# Altium schematic sheet Signals.SchDoc
size A2
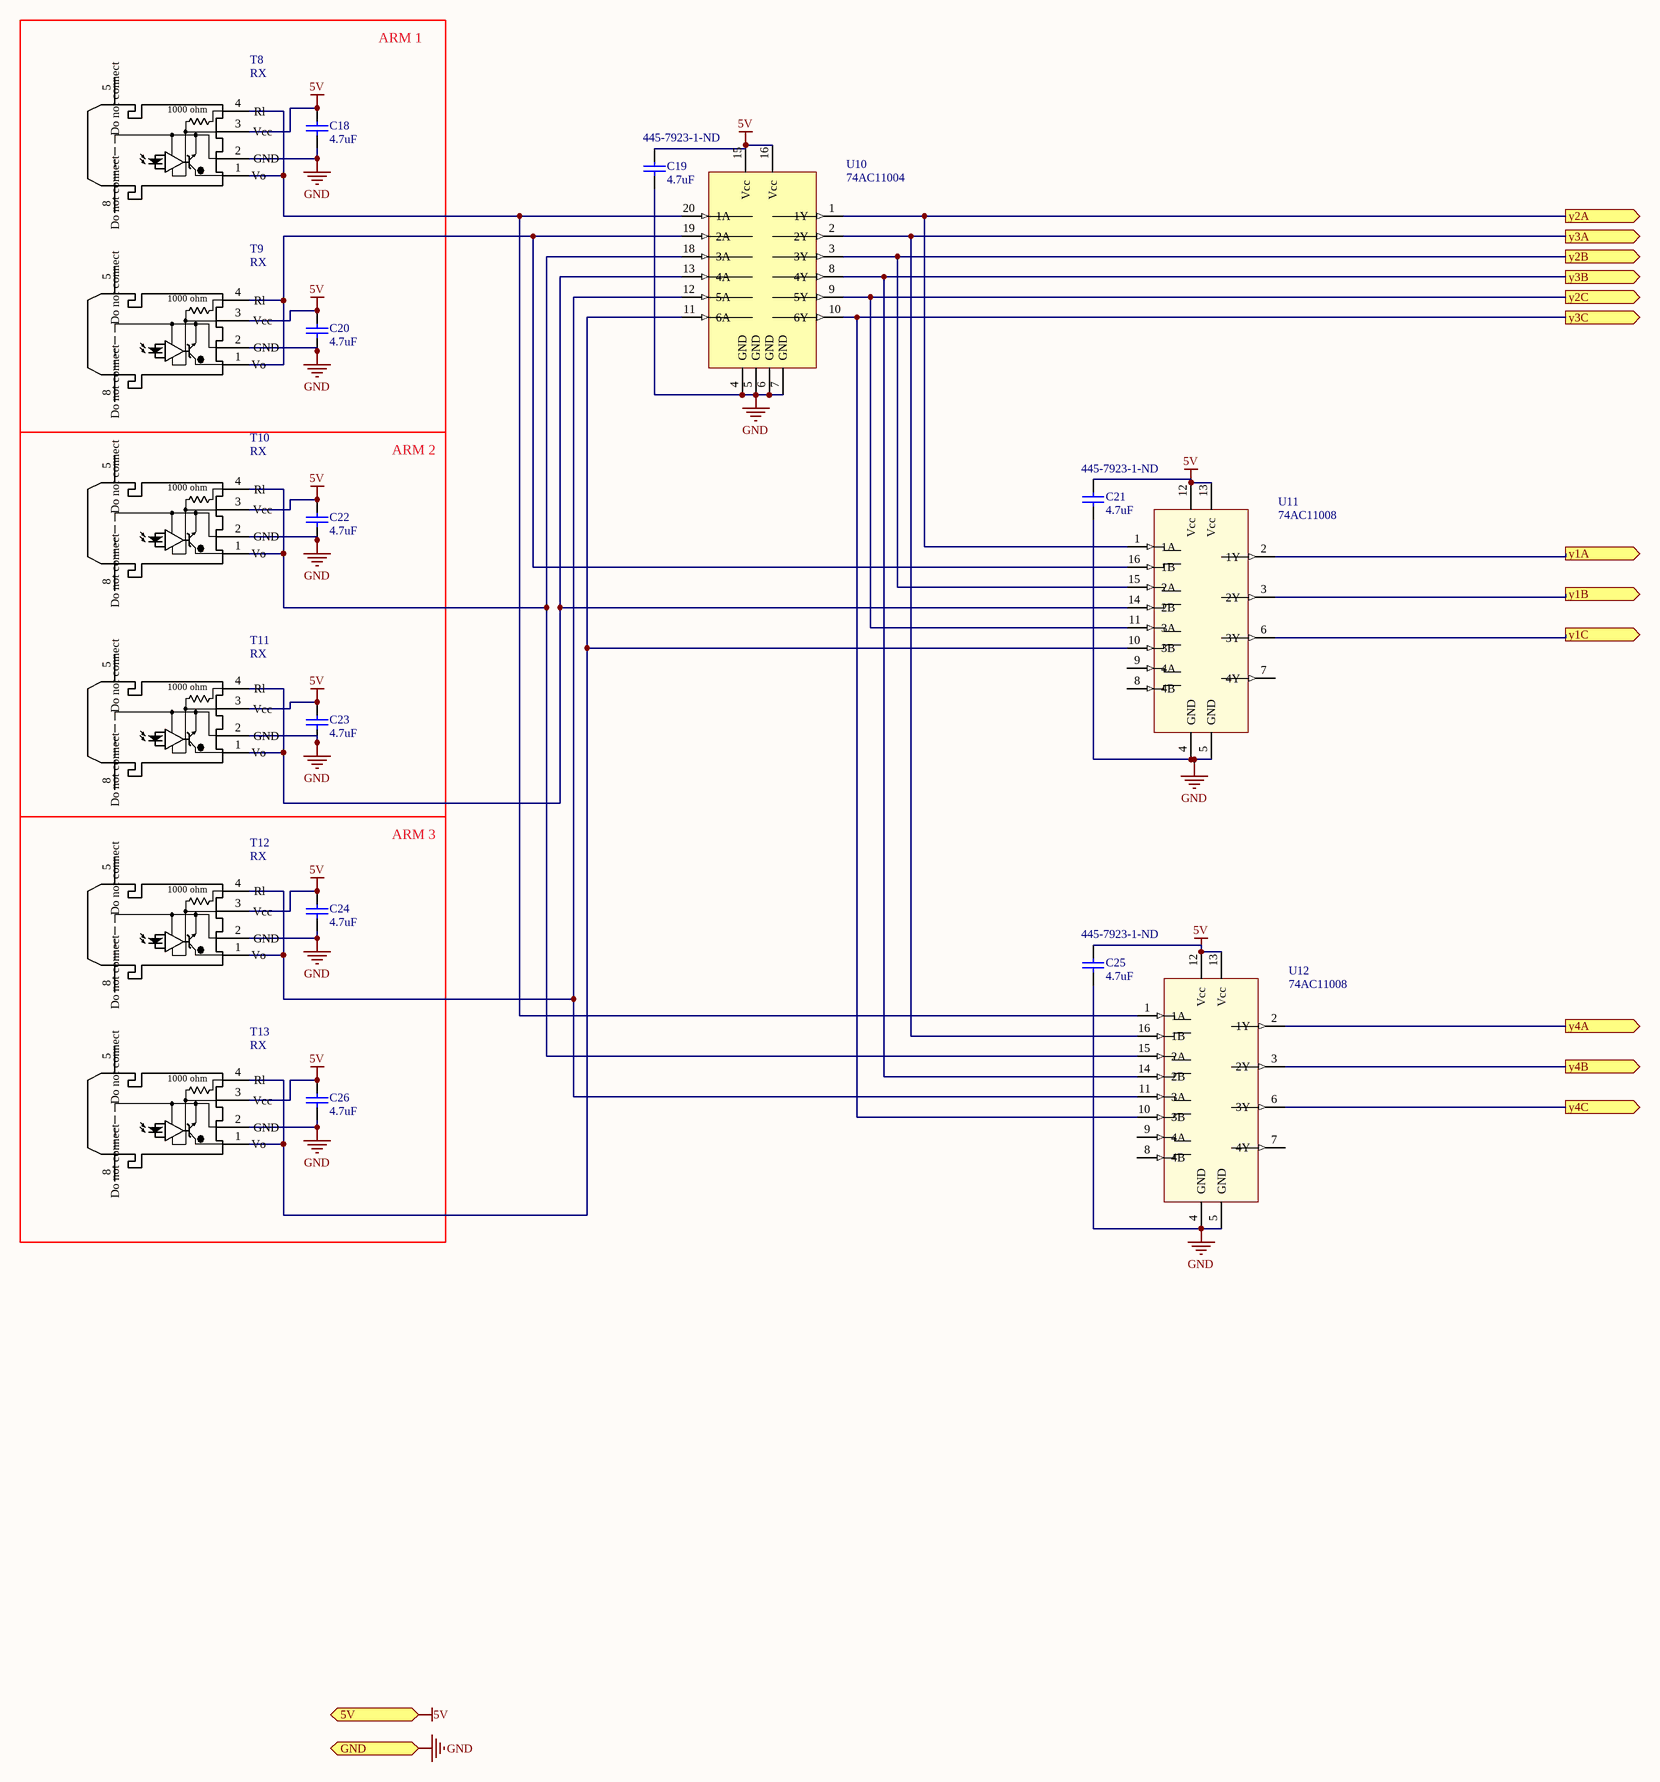
[diagram p0: Signals.SchDoc]

## Parts
C18  value 4.7uF  [C4532]  (hidden comment: Cap)
C19  value 4.7uF  Supplier Part Number 1: 445-7923-1-ND  [C4532]  (hidden comment: Cap)
C20  value 4.7uF  [C4532]  (hidden comment: Cap)
C21  value 4.7uF  Supplier Part Number 1: 445-7923-1-ND  [C4532]  (hidden comment: Cap)
C22  value 4.7uF  [C4532]  (hidden comment: Cap)
C23  value 4.7uF  [C4532]  (hidden comment: Cap)
C24  value 4.7uF  [C4532]  (hidden comment: Cap)
C25  value 4.7uF  Supplier Part Number 1: 445-7923-1-ND  [C4532]  (hidden comment: Cap)
C26  value 4.7uF  [C4532]  (hidden comment: Cap)
T8  RX  [Optics]
T9  RX  [Optics]
T10  RX  [Optics]
T11  RX  [Optics]
T12  RX  [Optics]
T13  RX  [Optics]
U10  74AC11004  [R-PDIP-T20]
U11  74AC11008  [R-PDIP-T16]
U12  74AC11008  [R-PDIP-T16]

## Blocks framed on the sheet
ARM 1: C18 C20 T8 T9
ARM 2: C22 C23 T10 T11
ARM 3: C24 C26 T12 T13

## Ports
5V, GND, y1A (out), y1B (out), y1C (out), y2A (out), y2B (out), y2C (out), y3A (out), y3B (out), y3C (out), y4A (out), y4B (out), y4C (out)

## Nets
5V: C18.2 C19.2 C20.2 C21.2 C22.2 C23.2 C24.2 C25.2 C26.2 T8.3(Vcc) T9.3(Vcc) T10.3(Vcc) T11.3(Vcc) T12.3(Vcc) T13.3(Vcc) U10.15(Vcc) U10.16(Vcc) U11.12(Vcc) U11.13(Vcc) U12.12(Vcc) U12.13(Vcc) ; port 5V
GND: C18.1 C19.1 C20.1 C21.1 C22.1 C23.1 C24.1 C25.1 C26.1 T8.2(GND) T9.2(GND) T10.2(GND) T11.2(GND) T12.2(GND) T13.2(GND) U10.4(GND) U10.5(GND) U10.6(GND) U10.7(GND) U11.4(GND) U11.5(GND) U12.4(GND) U12.5(GND) ; port GND
y1A: U11.2(1Y) ; port y1A
y1B: U11.3(2Y) ; port y1B
y1C: U11.6(3Y) ; port y1C
y2A: U10.1(1Y) U11.1(1A) ; port y2A
y2B: U10.3(3Y) U11.15(2A) ; port y2B
y2C: U10.9(5Y) U11.11(3A) ; port y2C
y3A: U10.2(2Y) U12.16(1B) ; port y3A
y3B: U10.8(4Y) U12.14(2B) ; port y3B
y3C: U10.10(6Y) U12.10(3B) ; port y3C
y4A: U12.2(1Y) ; port y4A
y4B: U12.3(2Y) ; port y4B
y4C: U12.6(3Y) ; port y4C
NetT8_1: T8.1(Vo) T8.4(Rl) U10.20(1A) U12.1(1A)
NetT9_1: T9.1(Vo) T9.4(Rl) U10.19(2A) U11.16(1B)
NetT10_1: T10.1(Vo) T10.4(Rl) U10.18(3A) U12.15(2A)
NetT11_1: T11.1(Vo) T11.4(Rl) U10.13(4A) U11.14(2B)
NetT12_1: T12.1(Vo) T12.4(Rl) U10.12(5A) U12.11(3A)
NetT13_1: T13.1(Vo) T13.4(Rl) U10.11(6A) U11.10(3B)

Not connected (* = marked no-connect by the designer): T8 5(Do_not_connect) 8(Do_not_connect); T9 5(Do_not_connect) 8(Do_not_connect); T10 5(Do_not_connect) 8(Do_not_connect); T11 5(Do_not_connect) 8(Do_not_connect); T12 5(Do_not_connect) 8(Do_not_connect); T13 5(Do_not_connect) 8(Do_not_connect); U11 7(4Y) 8(4B) 9(4A); U12 7(4Y) 8(4B) 9(4A)

## Notes on the sheet
- (in symbol HFBR-2524Z) 1000 ohm

## Library data of the parts
C18 C20 C22-C24 C26 = Cap: Capacitor; Published: 8-Jun-2000; LatestRevisionDate: 17-Jul-2002; LatestRevisionNote: Re-released for DXP Platform.; PackageReference: RAD-0.3; Publisher: Altium Limited; PackageDescription: Radial Cap, Thru-Hole; 2 Leads; 0.3 in Pin Spacing
C19 C21 C25 = Cap: Capacitor; Manufacturer: TDK; Manufacturer Part Number: CGA8N3X7S2A475K230KB; Tolerance: 10%; Voltage Rating: 100V; Dielectric: X7S; Published: 8-Jun-2000; LatestRevisionDate: 17-Jul-2002; LatestRevisionNote: Re-released for DXP Platform.; PackageReference: RAD-0.3; Publisher: Altium Limited; PackageDescription: Radial Cap, Thru-Hole; 2 Leads; 0.3 in Pin Spacing; Supplier 1: Digi-Key; Stock 1: 0; Pricing 1: 1=1.92, 10=1.518, 100=1.1385 (USD); Case/Package: 1812; Weight: 0.000952oz; Case Code (Metric): 4532; Case Code (Imperial): 1812; Min Operating Temperature: -55°C; Max Operating Temperature: 125°C; Packaging: Tape and Reel; Package Quantity: 1; Capacitance: 4.7uF; Voltage Rating (DC): 100V; Termination: SMD/SMT; Composition: Ceramic; Length: 4.5mm; Height: 1.6mm; Width: 0.126inch; Thickness: 0.091inch; Depth: 3.2mm; REACH SVHC: No SVHC; ComponentLink1URL: https://datasheet.ciiva.com/24217/cga8n3x7s2a475k230kb-266118-24217101.pdf; ComponentLink1Description: https://datasheet.ciiva.com/24217/cga8n3x7s2a475k230kb-266118-24217101.pdf
T8-T13 = HFBR-2524Z: Optical Reciever
U10 = 74AC11004: Hex Inverter; Manufacturer: Texas Instruments; Manufacturer Part Number: 74AC11004N; Logic Function: Buffer,Inverter; Number of Elements: 6; Supply Voltage: 5V; Propagation Delay: 10ns; Max Supply Voltage: 5.5V; Min Supply Voltage: 3V; Number of Inputs: 1; Output Current: 24mA; Quiescent Current: 4uA; High Level Output Current: -24mA; Schmitt Trigger Input: No; Supplier 1: Digikey; Stock 1: 747; Pricing 1: 1=2.36, 10=2.12, 100=1.704, 500=1.4, 1000=1.16 (USD); Mount: Through Hole; Case/Package: PDIP; Number of Pins: 20; Weight: 0.042297oz; Contact Plating: Gold; Min Operating Temperature: -40°C; Max Operating Temperature: 85°C; Packaging: Rail/Tube; Package Quantity: 20; Number of Circuits: 6; Low Level Output Current: 24mA; Turn-On Delay Time: 10ns; Number of Gates: 6; Number of Bits: 6; Length: 26.92mm; Height: 4.57mm; Width: 6.6mm; Radiation Hardening: No; Lead Free: Lead Free; REACH SVHC: No SVHC; ComponentLink1URL: https://datasheet.ciiva.com/14289/74ac11004-14289990.pdf; ComponentLink1Description: https://datasheet.ciiva.com/14289/74ac11004-14289990.pdf; ComponentLink2URL: https://datasheet.ciiva.com/1869/74ac11004-1869911.pdf; ComponentLink2Description: https://datasheet.ciiva.com/1869/74ac11004-1869911.pdf; ComponentLink3URL: https://datasheet.ciiva.com/1157/1763878-1157128.pdf; ComponentLink3Description: https://datasheet.ciiva.com/1157/1763878-1157128.pdf; ComponentLink4URL: https://datasheet.ciiva.com/15089/getdatasheetpartid-371764-15089641.pdf; ComponentLink4Description: https://datasheet.ciiva.com/15089/getdatasheetpartid-371764-15089641.pdf; ComponentLink5URL: https://datasheet.ciiva.com/1153/1817335-1153741.pdf; ComponentLink5Description: https://datasheet.ciiva.com/1153/1817335-1153741.pdf; ComponentLink6URL: https://datasheet.ciiva.com/41426/001015348-da-01-en-ic-hex-inverter-7-74ac11004n-pdip-20-tid-41426322.pdf; ComponentLink6Description: https://datasheet.ciiva.com/41426/001015348-da-01-en-ic-hex-inverter-7-74ac11004n-pdip-20-tid-41426322.pdf; Supplier Part Number 1: 296-4153-5-ND
U11 U12 = 74AC11008: AND GATE; Manufacturer: Texas Instruments; Manufacturer Part Number: 74AC11008N; Number of Inputs: 2; Propagation Delay: 6.9ns; Min Supply Voltage: 3V; Max Supply Voltage: 5.5V; Number of Outputs: 1; Supply Voltage: 5V; Output Current: 24mA; Number of Circuits: 4; Quiescent Current: 4uA; High Level Output Current: -24mA; Schmitt Trigger Input: No; Supplier 1: Digikey; Stock 1: 236; Pricing 1: 1=2.36, 10=2.12, 100=1.704, 500=1.4, 1000=1.16 (USD); Mount: Through Hole; Case/Package: DIP; Number of Pins: 16; Weight: 0.03357oz; Contact Plating: Gold; Min Operating Temperature: -40°C; Max Operating Temperature: 85°C; Package Quantity: 25; Packaging: Rail/Tube; Logic Function: AND; Low Level Output Current: 24mA; Number of Gates: 4; Number of Elements: 4; Number of Input Lines: 2; Number of Output Lines: 1; Turn-On Delay Time: 6.9ns; Number of Bits: 4; Length: 19.69mm; Height: 4.57mm; Width: 6.6mm; Radiation Hardening: No; Lead Free: Lead Free; REACH SVHC: No SVHC; ComponentLink1URL: https://datasheet.ciiva.com/1869/74ac11008-1869907.pdf; ComponentLink1Description: https://datasheet.ciiva.com/1869/74ac11008-1869907.pdf; ComponentLink2URL: https://datasheet.ciiva.com/15215/getdatasheetpartid-541532-15215429.pdf; ComponentLink2Description: https://datasheet.ciiva.com/15215/getdatasheetpartid-541532-15215429.pdf; Supplier Part Number 1: 296-4154-5-ND